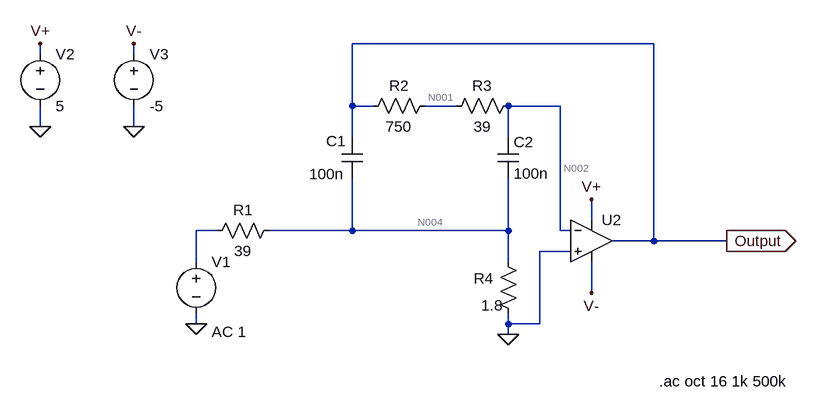
[diagram p0: schematic TI_BPF.asc]
TI_BPF.asc, the LTspice schematic file:
Version 4
SHEET 1 1012 680
WIRE 448 -96 -16 -96
WIRE -496 -80 -496 -96
WIRE -352 -80 -352 -96
WIRE -16 0 -16 -96
WIRE 16 0 -16 0
WIRE 144 0 96 0
WIRE 304 0 224 0
WIRE -496 32 -496 0
WIRE -352 32 -352 0
WIRE -16 48 -16 0
WIRE 224 48 224 0
WIRE 352 176 352 144
WIRE -224 192 -256 192
WIRE -16 192 -16 112
WIRE -16 192 -144 192
WIRE 224 192 224 112
WIRE 224 192 -16 192
WIRE 304 192 304 0
WIRE 320 192 304 192
WIRE 448 208 448 -96
WIRE 448 208 384 208
WIRE 560 208 448 208
WIRE 320 224 272 224
WIRE -256 240 -256 192
WIRE 224 240 224 192
WIRE 352 288 352 240
WIRE -256 336 -256 320
WIRE 224 336 224 320
WIRE 272 336 272 224
WIRE 272 336 224 336
WIRE 224 352 224 336
FLAG 224 352 0
FLAG 560 208 Output
IOPIN 560 208 Out
FLAG -256 336 0
FLAG -496 32 0
FLAG -352 32 0
FLAG -496 -96 V+
FLAG -352 -96 V-
FLAG 352 144 V+
FLAG 352 288 V-
SYMBOL res -240 208 R270
WINDOW 0 32 56 VTop 2
WINDOW 3 0 56 VBottom 2
SYMATTR InstName R1
SYMATTR Value 39
SYMBOL res 0 16 R270
WINDOW 0 32 56 VTop 2
WINDOW 3 0 56 VBottom 2
SYMATTR InstName R2
SYMATTR Value 750
SYMBOL res 128 16 R270
WINDOW 0 32 56 VTop 2
WINDOW 3 0 56 VBottom 2
SYMATTR InstName R3
SYMATTR Value 39
SYMBOL res 208 224 R0
WINDOW 0 -37 42 Left 2
WINDOW 3 -26 83 Left 2
SYMATTR InstName R4
SYMATTR Value 1.8
SYMBOL cap -32 48 R0
WINDOW 0 -24 6 Left 2
WINDOW 3 -50 57 Left 2
SYMATTR InstName C1
SYMATTR Value 100n
SYMBOL cap 208 48 R0
SYMATTR InstName C2
SYMATTR Value 100n
SYMBOL voltage -256 224 R0
WINDOW 123 24 124 Left 2
WINDOW 39 0 0 Left 2
SYMATTR InstName V1
SYMATTR Value ""
SYMATTR Value2 AC 1
SYMBOL Opamps\\UniversalOpamp2 352 208 R0
SYMATTR InstName U2
SYMBOL voltage -496 -96 R0
WINDOW 123 0 0 Left 2
WINDOW 39 0 0 Left 2
SYMATTR InstName V2
SYMATTR Value 5
SYMBOL voltage -352 -96 R0
WINDOW 123 0 0 Left 2
WINDOW 39 0 0 Left 2
SYMATTR InstName V3
SYMATTR Value -5
TEXT 456 424 Left 2 !.ac oct 16 1k 500k

The netlist it stands for:
* TI_BPF.asc
R1 N003 N004 39
R2 Output N001 750
R3 N001 N002 39
R4 N004 0 1.8
C1 Output N004 100n
C2 N002 N004 100n
V1 N003 0 AC 1
XU2 0 N002 V+ V- Output level.2 Avol=1Meg GBW=10Meg Slew=10Meg ilimit=25m rail=0 Vos=0 phimargin=45 en=0 enk=0 in=0 ink=0 Rin=500Meg  ; pins IN+ IN- V+ V- OUT
V2 V+ 0 5
V3 V- 0 -5
.ac oct 16 1k 500k
.lib UniversalOpamps2.sub
.backanno
.end

* Results of the author's LTspice run, read from the files saved beside the schematic
* Operating Point, zero values left out:
*   V(v+) = 5 V
*   V(v-) = -5 V
*   I(V3) = 500 µA
*   I(V2) = -500 µA
*   Ix(u2:3) = 500 µA
*   Ix(u2:4) = -500 µA
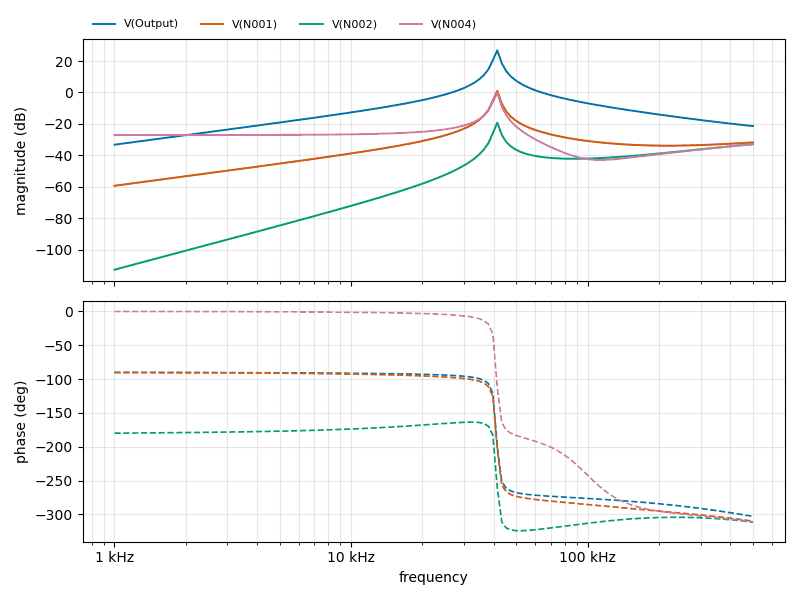
[diagram p1: AC Analysis of TI_BPF.asc, plotted from the saved traces]
* AC Analysis, 1 run:
*   V(Output): -33.20 dB at 1 kHz, -21.38 dB at 500 kHz, peak 26.74 dB at 41.5 kHz, 3 dB below the peak at 40.63 kHz and 42.17 kHz
*   V(N001): -59.32 dB at 1 kHz, -31.78 dB at 500 kHz, peak 1.05 dB at 41.5 kHz, 3 dB below the peak at 40.64 kHz and 42.17 kHz
*   V(N002): -112.67 dB at 1 kHz, -32.87 dB at 500 kHz, peak -19.21 dB at 41.5 kHz, 3 dB below the peak at 40.69 kHz and 42.21 kHz
*   V(N004): -27.10 dB at 1 kHz, -32.89 dB at 500 kHz, peak -0.36 dB at 41.5 kHz, 3 dB below the peak at 40.57 kHz and 42.13 kHz